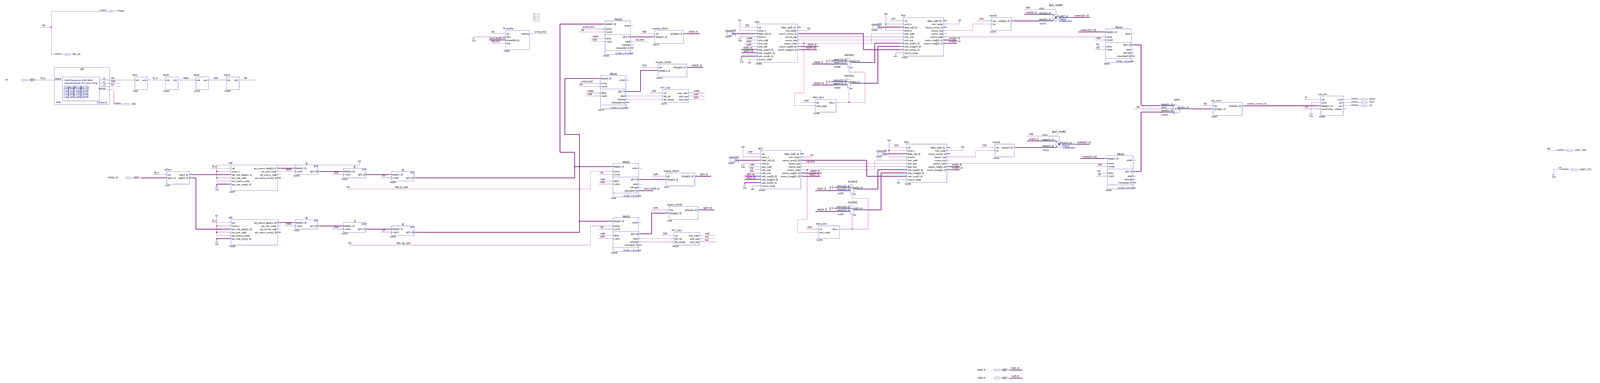
[diagram p0: schematic sheet, whole]
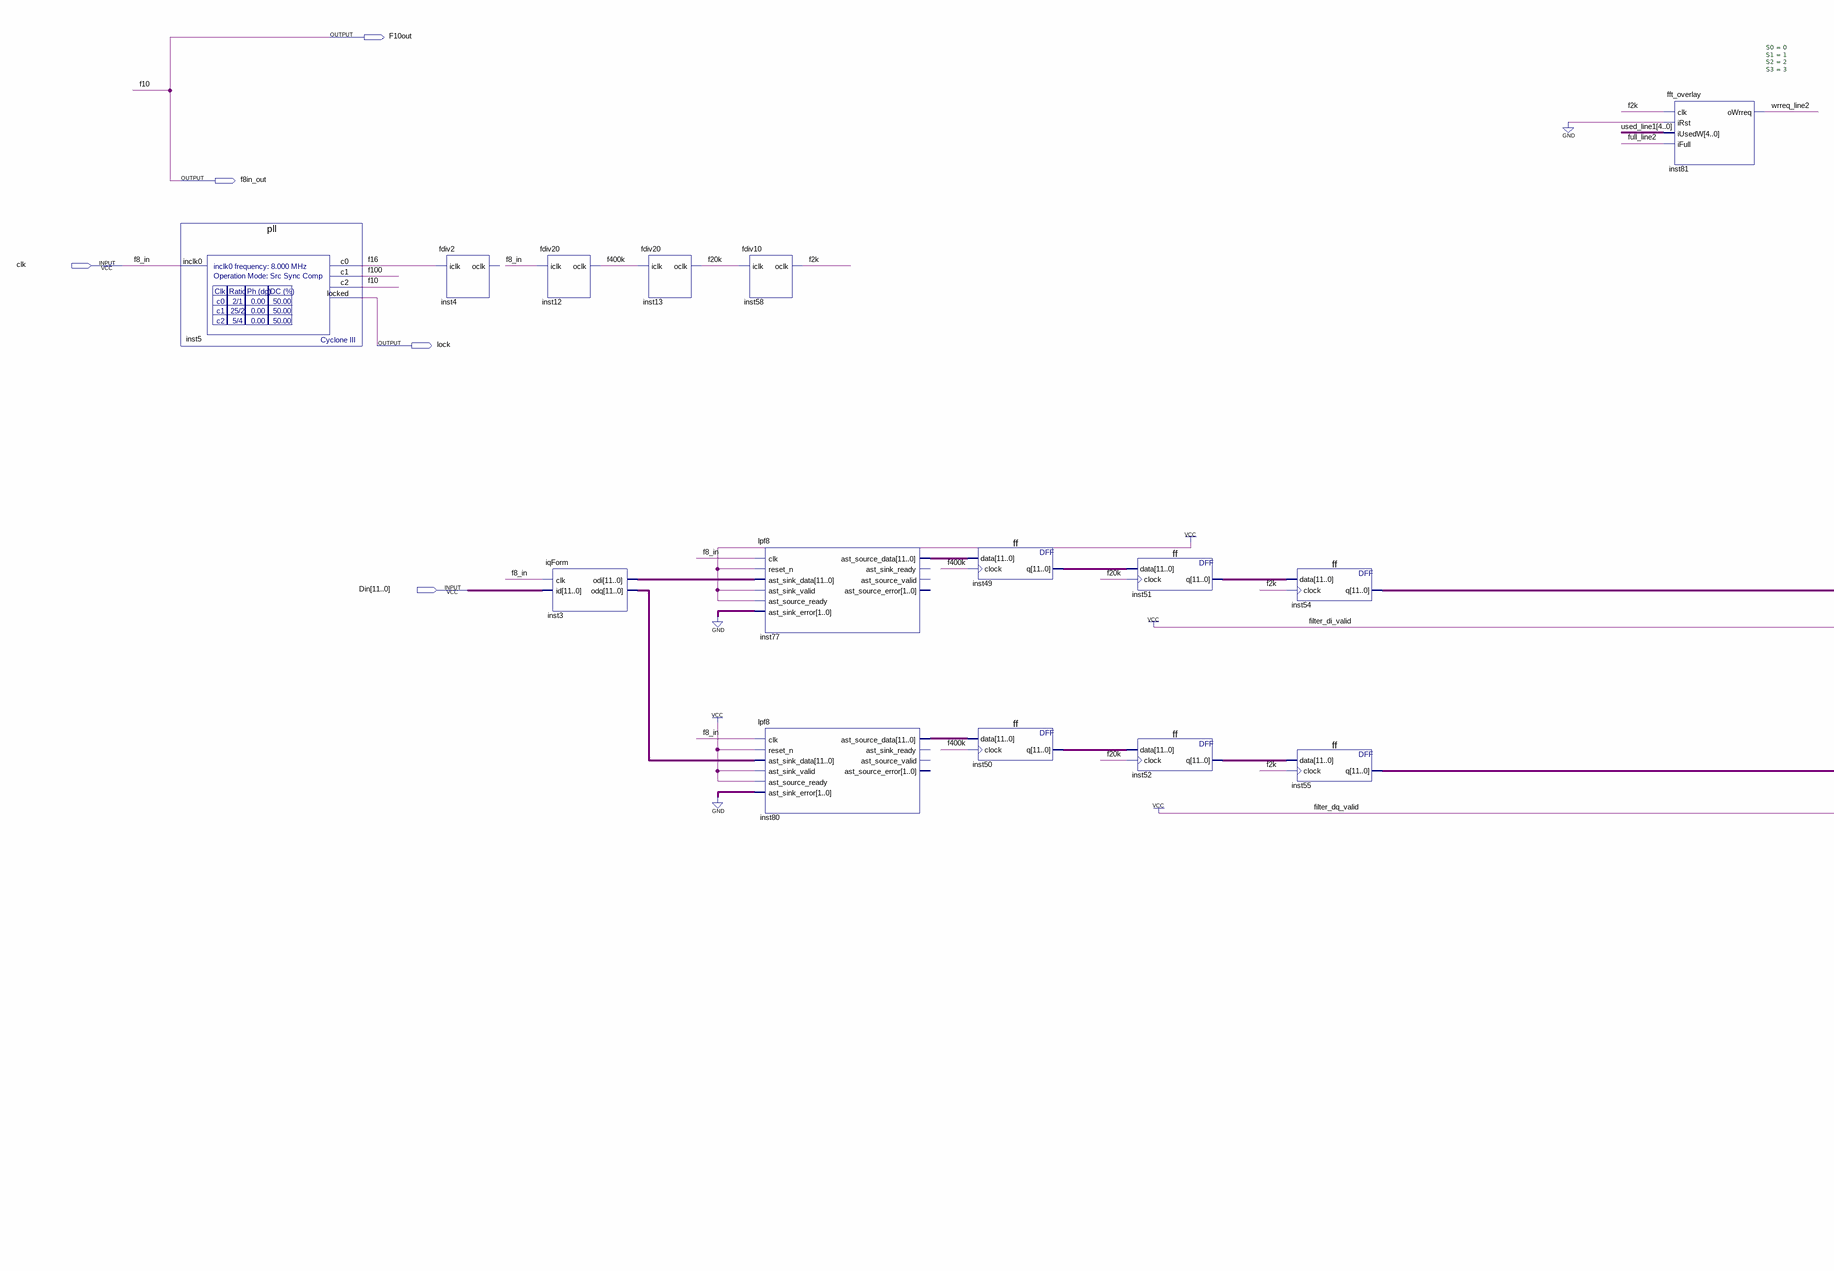
[diagram p1: schematic sheet, left part]
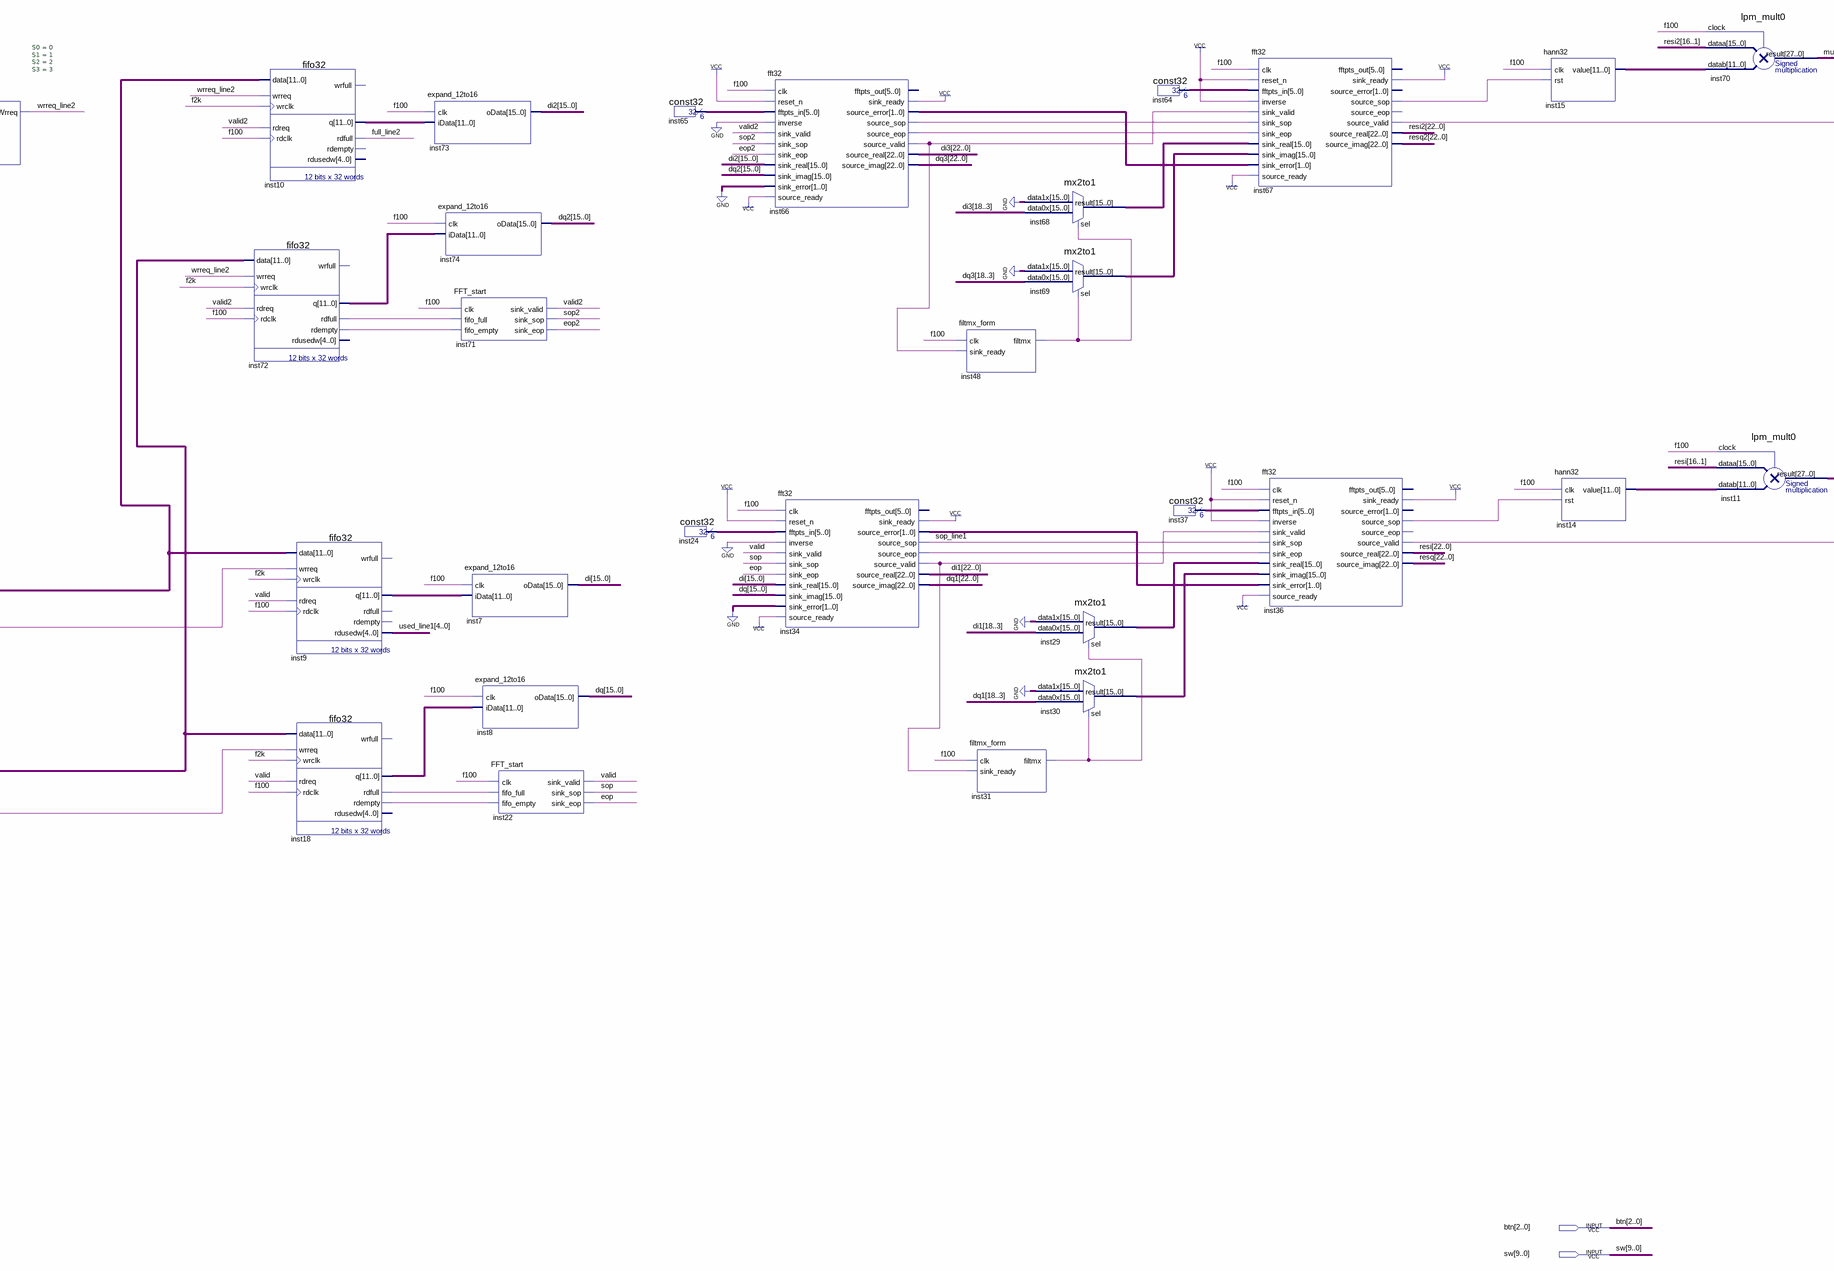
[diagram p2: schematic sheet, centre part]
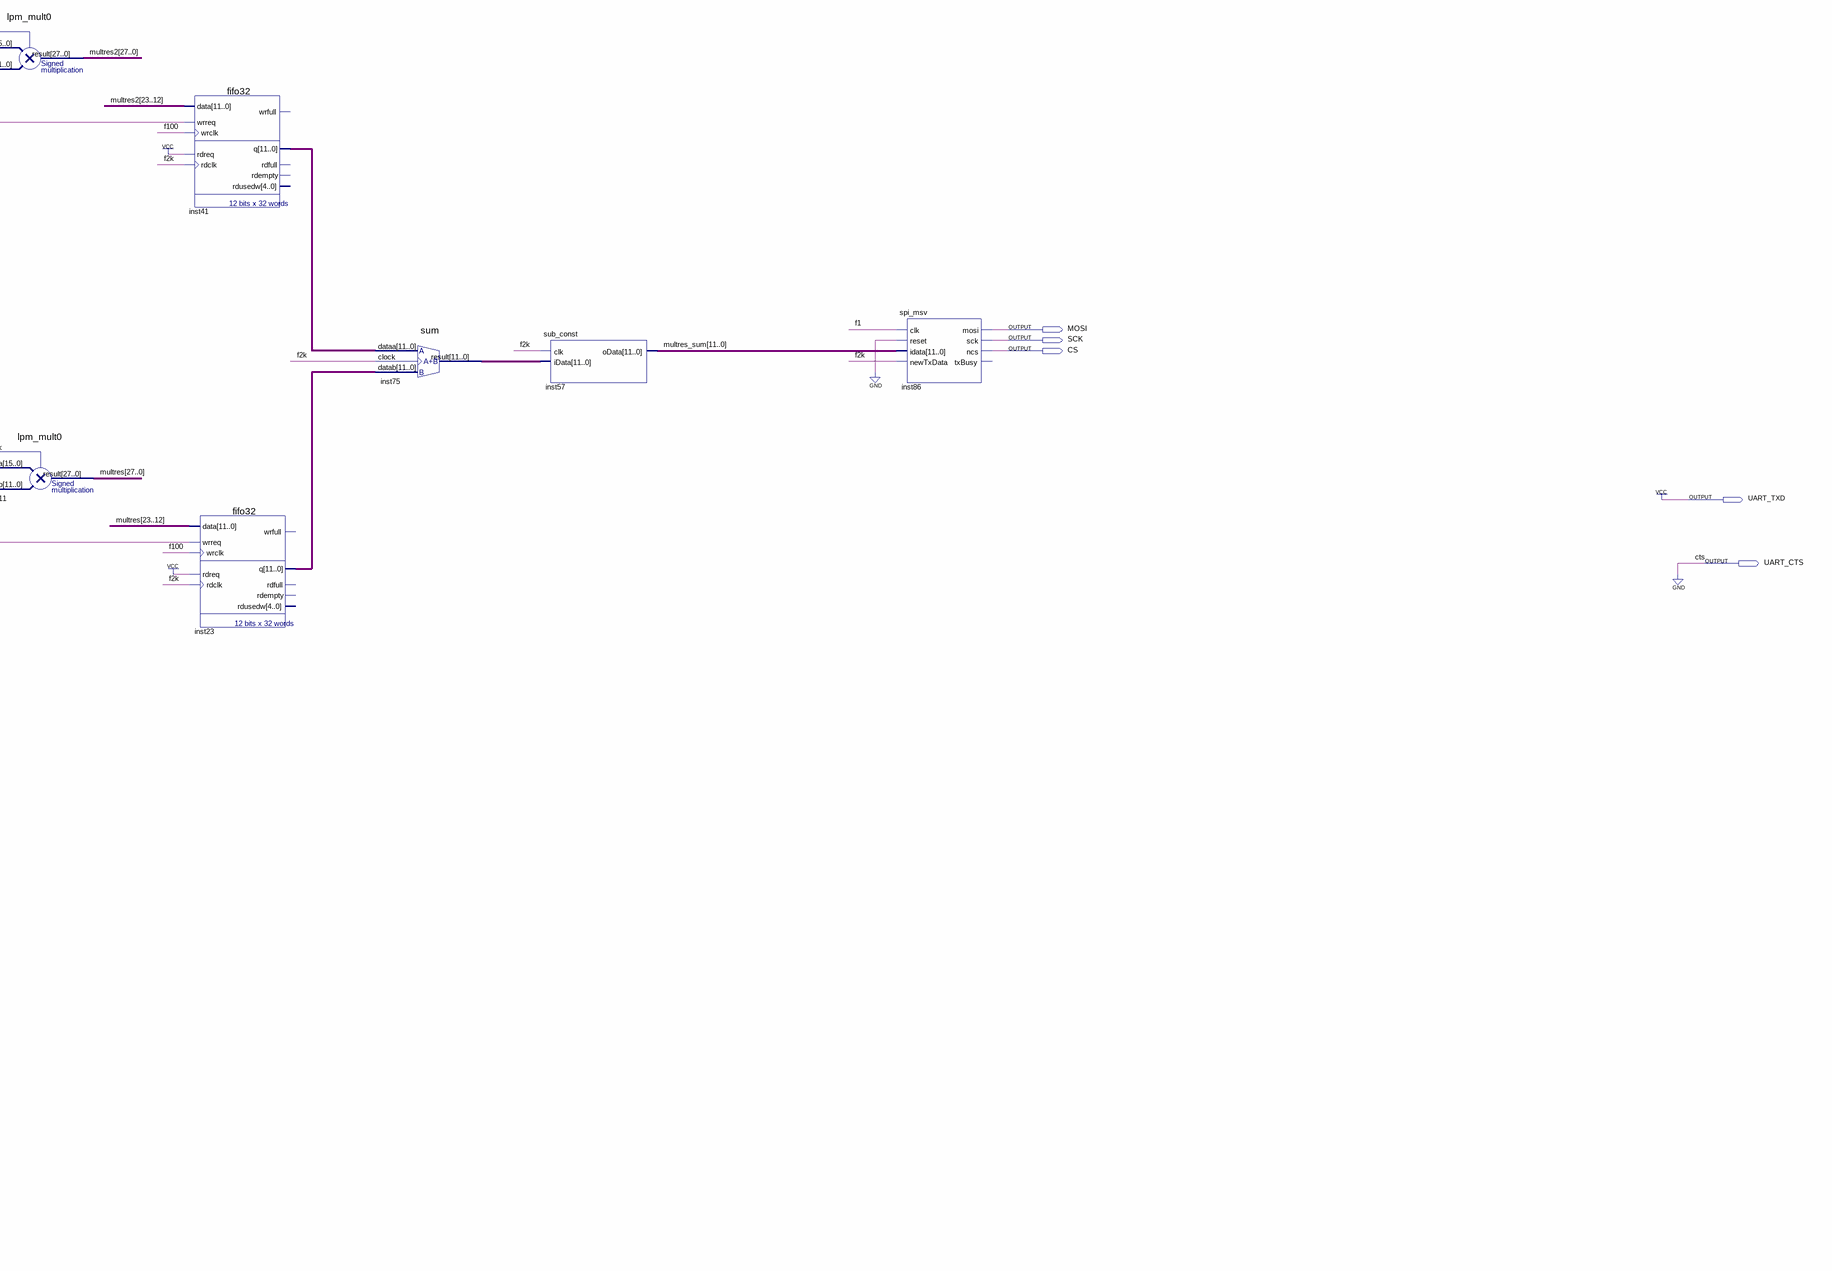
[diagram p3: schematic sheet, right part]
// Quartus schematic usd_cyclone3.bdf as structural Verilog: 48 symbols, 12 pins
module usd_cyclone3 (
  input  clk,
  input  [11:0] Din,
  input  [2:0] btn,
  input  [9:0] sw,
  output F10out,
  output f8in_out,
  output MOSI,
  output SCK,
  output lock,
  output CS,
  output UART_TXD,
  output UART_CTS
);

  wire eop, eop2, f1, f2k, f16, f20k, f100, f400k, full_line2, inst18_rdempty, inst18_rdfull, inst31_filtmx,
       inst34_sink_ready, inst34_source_eop, inst34_source_valid, inst36_sink_ready, inst36_source_sop,
       inst36_source_valid, inst48_filtmx, inst66_sink_ready, inst66_source_eop, inst66_source_sop,
       inst66_source_valid, inst67_sink_ready, inst67_source_sop, inst67_source_valid, inst72_rdempty,
       inst72_rdfull, sop, sop2, sop_line1, valid, valid2, wrreq_line2;
  wire [1:0] inst34_source_error, inst66_source_error;
  wire [4:0] used_line1;
  wire [5:0] inst24_result, inst37_result, inst64_result, inst65_result;
  wire [11:0] inst3_odi, inst3_odq, inst9_q, inst10_q, inst14_value, inst15_value, inst18_q, inst23_q,
       inst41_q, inst49_q, inst50_q, inst51_q, inst52_q, inst54_q, inst55_q, inst72_q, inst75_result,
       inst77_ast_source_data, inst80_ast_source_data, multres_sum;
  wire [15:0] di, di2, dq, dq2, inst29_result, inst30_result, inst68_result, inst69_result;
  wire [22:0] di1, di3, dq1, dq3, resi, resi2, resq, resq2;
  wire [27:0] multres, multres2;

  pll inst5 (.inclk0(clk), .c0(f16), .c1(f100), .c2(f8in_out), .locked(lock));
  fdiv2 inst4 (.iclk(f16));  // open: oclk
  fdiv20 inst12 (.iclk(clk), .oclk(f400k));
  iqForm inst3 (.clk(clk), .id(Din), .odi(inst3_odi), .odq(inst3_odq));
  fdiv20 inst13 (.iclk(f400k), .oclk(f20k));
  fdiv10 inst58 (.iclk(f20k), .oclk(f2k));
  lpf8 inst77 (
    .clk(clk), .reset_n(1'b1), .ast_sink_data(inst3_odi), .ast_sink_valid(1'b1), .ast_source_ready(1'b1),
    .ast_sink_error(2'b00), .ast_source_data(inst77_ast_source_data));  // open: ast_sink_ready, ast_source_valid, ast_source_error
  lpf8 inst80 (
    .clk(clk), .reset_n(1'b1), .ast_sink_data(inst3_odq), .ast_sink_valid(1'b1), .ast_source_ready(1'b1),
    .ast_sink_error(2'b00), .ast_source_data(inst80_ast_source_data));  // open: ast_sink_ready, ast_source_valid, ast_source_error
  ff inst49 (.data(inst77_ast_source_data), .clock(f400k), .q(inst49_q));
  ff inst50 (.data(inst80_ast_source_data), .clock(f400k), .q(inst50_q));
  ff inst51 (.data(inst49_q), .clock(f20k), .q(inst51_q));
  ff inst52 (.data(inst50_q), .clock(f20k), .q(inst52_q));
  ff inst54 (.data(inst51_q), .clock(f2k), .q(inst54_q));
  ff inst55 (.data(inst52_q), .clock(f2k), .q(inst55_q));
  fft_overlay #(.S0(0), .S1(1), .S2(2), .S3(3)) inst81 (
    .clk(f2k), .iRst(1'b0), .iUsedW(used_line1), .iFull(full_line2), .oWrreq(wrreq_line2));
  fifo32 inst10 (
    .data(inst54_q), .wrreq(wrreq_line2), .wrclk(f2k), .rdreq(valid2), .rdclk(f100), .q(inst10_q),
    .rdfull(full_line2));  // open: wrfull, rdempty, rdusedw
  fifo32 inst72 (
    .data(inst55_q), .wrreq(wrreq_line2), .wrclk(f2k), .rdreq(valid2), .rdclk(f100), .q(inst72_q),
    .rdfull(inst72_rdfull), .rdempty(inst72_rdempty));  // open: wrfull, rdusedw
  fifo32 inst9 (
    .data(inst54_q), .wrreq(1'b1), .wrclk(f2k), .rdreq(valid), .rdclk(f100), .q(inst9_q), .rdusedw(used_line1));  // open: wrfull, rdfull, rdempty
  fifo32 inst18 (
    .data(inst55_q), .wrreq(1'b1), .wrclk(f2k), .rdreq(valid), .rdclk(f100), .q(inst18_q),
    .rdfull(inst18_rdfull), .rdempty(inst18_rdempty));  // open: wrfull, rdusedw
  expand_12to16 inst73 (.clk(f100), .iData(inst10_q), .oData(di2));
  expand_12to16 inst74 (.clk(f100), .iData(inst72_q), .oData(dq2));
  FFT_start inst71 (
    .clk(f100), .fifo_full(inst72_rdfull), .fifo_empty(inst72_rdempty), .sink_valid(valid2), .sink_sop(sop2),
    .sink_eop(eop2));
  expand_12to16 inst7 (.clk(f100), .iData(inst9_q), .oData(di));
  expand_12to16 inst8 (.clk(f100), .iData(inst18_q), .oData(dq));
  FFT_start inst22 (
    .clk(f100), .fifo_full(inst18_rdfull), .fifo_empty(inst18_rdempty), .sink_valid(valid), .sink_sop(sop),
    .sink_eop(eop));
  const32 inst65 (.result(inst65_result));
  const32 inst24 (.result(inst24_result));
  fft32 inst66 (
    .clk(f100), .reset_n(1'b1), .fftpts_in(inst65_result), .inverse(1'b0), .sink_valid(valid2),
    .sink_sop(sop2), .sink_eop(eop2), .sink_real(di2), .sink_imag(dq2), .sink_error(2'b00),
    .source_ready(1'b1), .sink_ready(inst66_sink_ready), .source_error(inst66_source_error),
    .source_sop(inst66_source_sop), .source_eop(inst66_source_eop), .source_valid(inst66_source_valid),
    .source_real(di3), .source_imag(dq3));  // open: fftpts_out
  fft32 inst34 (
    .clk(f100), .reset_n(1'b1), .fftpts_in(inst24_result), .inverse(1'b0), .sink_valid(valid),
    .sink_sop(sop), .sink_eop(eop), .sink_real(di), .sink_imag(dq), .sink_error(2'b00), .source_ready(1'b1),
    .sink_ready(inst34_sink_ready), .source_error(inst34_source_error), .source_sop(sop_line1),
    .source_eop(inst34_source_eop), .source_valid(inst34_source_valid), .source_real(di1), .source_imag(dq1));  // open: fftpts_out
  filtmx_form inst48 (.clk(f100), .sink_ready(inst66_source_valid), .filtmx(inst48_filtmx));
  filtmx_form inst31 (.clk(f100), .sink_ready(inst34_source_valid), .filtmx(inst31_filtmx));
  mx2to1 inst68 (.data1x({16{1'b0}}), .data0x(di3[18:3]), .sel(inst48_filtmx), .result(inst68_result));
  mx2to1 inst69 (.data1x({16{1'b0}}), .data0x(dq3[18:3]), .sel(inst48_filtmx), .result(inst69_result));
  mx2to1 inst29 (.data1x({16{1'b0}}), .data0x(di1[18:3]), .sel(inst31_filtmx), .result(inst29_result));
  mx2to1 inst30 (.data1x({16{1'b0}}), .data0x(dq1[18:3]), .sel(inst31_filtmx), .result(inst30_result));
  const32 inst64 (.result(inst64_result));
  const32 inst37 (.result(inst37_result));
  fft32 inst67 (
    .clk(f100), .reset_n(1'b1), .fftpts_in(inst64_result), .inverse(1'b1), .sink_valid(inst66_source_valid),
    .sink_sop(inst66_source_sop), .sink_eop(inst66_source_eop), .sink_real(inst68_result),
    .sink_imag(inst69_result), .sink_error(inst66_source_error), .source_ready(1'b1),
    .sink_ready(inst67_sink_ready), .source_sop(inst67_source_sop), .source_valid(inst67_source_valid),
    .source_real(resi2), .source_imag(resq2));  // open: fftpts_out, source_error, source_eop
  fft32 inst36 (
    .clk(f100), .reset_n(1'b1), .fftpts_in(inst37_result), .inverse(1'b1), .sink_valid(inst34_source_valid),
    .sink_sop(sop_line1), .sink_eop(inst34_source_eop), .sink_real(inst29_result), .sink_imag(inst30_result),
    .sink_error(inst34_source_error), .source_ready(1'b1), .sink_ready(inst36_sink_ready),
    .source_sop(inst36_source_sop), .source_valid(inst36_source_valid), .source_real(resi), .source_imag(resq));  // open: fftpts_out, source_error, source_eop
  hann32 inst15 (.clk(f100), .rst(inst67_source_sop), .value(inst15_value));
  hann32 inst14 (.clk(f100), .rst(inst36_source_sop), .value(inst14_value));
  lpm_mult0 inst70 (.dataa(resi2[16:1]), .datab(inst15_value), .clock(f100), .result(multres2));
  lpm_mult0 inst11 (.dataa(resi[16:1]), .datab(inst14_value), .clock(f100), .result(multres));
  fifo32 inst41 (
    .data(multres2[23:12]), .wrreq(inst67_source_valid), .wrclk(f100), .rdreq(1'b1), .rdclk(f2k), .q(inst41_q));  // open: wrfull, rdfull, rdempty, rdusedw
  fifo32 inst23 (
    .data(multres[23:12]), .wrreq(inst36_source_valid), .wrclk(f100), .rdreq(1'b1), .rdclk(f2k), .q(inst23_q));  // open: wrfull, rdfull, rdempty, rdusedw
  sum inst75 (.dataa(inst41_q), .datab(inst23_q), .clock(f2k), .result(inst75_result));
  sub_const inst57 (.clk(f2k), .iData(inst75_result), .oData(multres_sum));
  spi_msv inst86 (
    .clk(f1), .reset(1'b0), .idata(multres_sum), .newTxData(f2k), .mosi(MOSI), .sck(SCK), .ncs(CS));  // open: txBusy

  assign F10out = f8in_out;
  assign UART_CTS = 1'b0;
  assign UART_TXD = 1'b1;
  // also tied to VCC on the sheet: {inst34_sink_ready, inst36_sink_ready, inst67_sink_ready, inst66_sink_ready}

  // Other names for the same wires on the sheet: f8_in = clk; f10 = f8in_out
endmodule
